# Altium project USB_Wireless_Module.PrjPcb
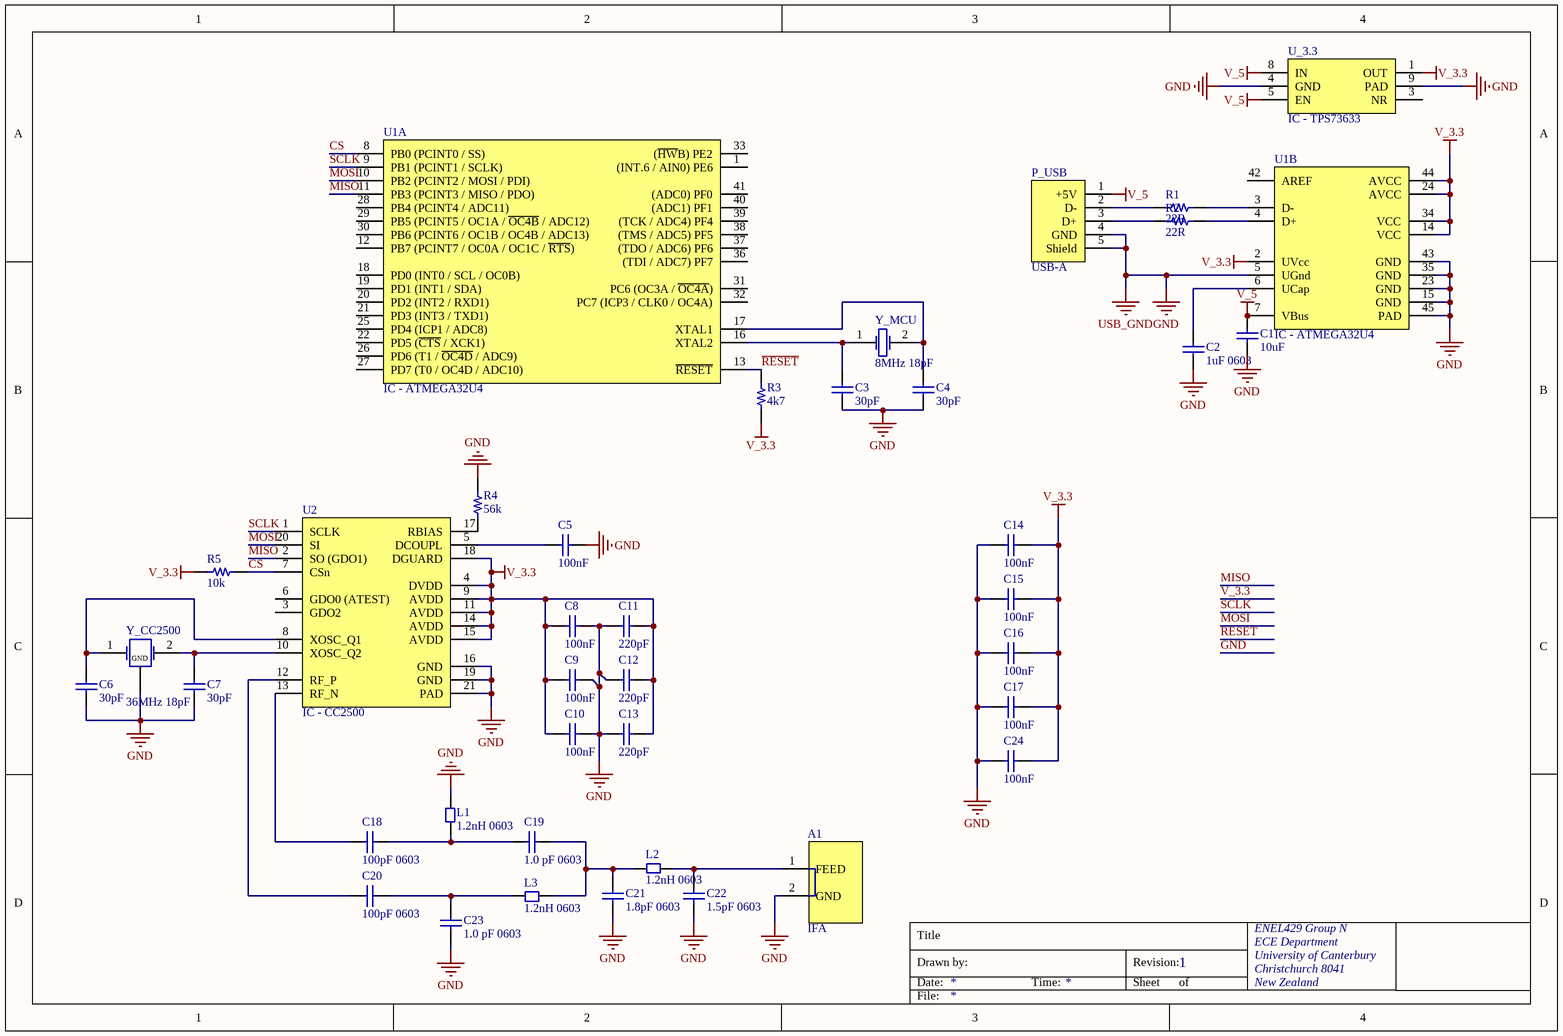
[diagram p0: USB_Wireless_Module.SchDoc]
1 sheet, 39 parts. Net scope: global (net labels, ports and power ports of the same name join across sheets).
Board file: USB_Wireless_Module.PcbDoc

## Sheet USB_Wireless_Module.SchDoc
size A4; Organization: ENEL429 Group N; Address1: ECE Department; Address2: University of Canterbury; Address3: Christchurch 8041; Address4: New Zealand; Revision: 1

### Parts
A1  IFA  [Meandered_Inverted_F_Antenna]
C1  10uF  [0603]
C2  1uF 0603  [0603]
C3  30pF  [0603]
C4  30pF  [0603]
C5  100nF  [0603]
C6  30pF  [0603]
C7  30pF  [0603]
C8  100nF  [0603]
C9  100nF  [0603]
C10  100nF  [0603]
C11  220pF  [0603]
C12  220pF  [0603]
C13  220pF  [0603]
C14  100nF  [0603]
C15  100nF  [0603]
C16  100nF  [0603]
C17  100nF  [0603]
C18  100pF 0603  [0603]
C19  1.0 pF 0603  [0603]
C20  100pF 0603  [0603]
C21  1.8pF 0603  [0603]
C22  1.5pF 0603  [0603]
C23  1.0 pF 0603  [0603]
C24  100nF  [0603]
L1  1.2nH 0603  [0603]
L2  1.2nH 0603  [0603]
L3  1.2nH 0603  [0603]
P_USB  USB-A  [480372200]
R1  22R  [0603]
R2  22R  [0603]
R3  4k7  [0603]
R4  56k  [0603]
R5  10k  [0603]
U1  IC - ATMEGA32U4  [QFN50P700X700X90-44N]  (parts A,B of 2)
U2  IC - CC2500  [TI - RTK / QFN50P400X400X90-20N]
U_3.3  IC - TPS73633  [TI - DRB / QFN65P300X300X100-8L]
Y_CC2500  36MHz 18pF  [7M-36.000MAAJ-T]
Y_MCU  8MHz 18pF  [ABM7-8.000MHZ-D-2-Y-T]

### Nets
GND: A1.2(GND) C1.1 C2.1 C3.1 C4.1 C5.2 C6.1 C7.1 C8.1 C9.1 C10.1 C11.1 C12.1 C13.1 C14.2 C15.2 C16.2 C17.2 C21.1 C22.1 C23.1 C24.2 L1.2 P_USB.4(GND) P_USB.5(Shield) R4.2 U1.5(UGnd) U1.15(GND) U1.23(GND) U1.35(GND) U1.43(GND) U1.45(PAD) U2.16(GND) U2.19(GND) U2.21(PAD) U_3.3.4(GND) U_3.3.9(PAD) Y_CC2500.3(GND)  [also labelled USB_GND]
V_3.3: C8.2 C9.2 C10.2 C11.2 C12.2 C13.2 C14.1 C15.1 C16.1 C17.1 C24.1 R3.1 R5.2 U1.2(UVcc) U1.14(VCC) U1.24(AVCC) U1.34(VCC) U1.44(AVCC) U2.4(DVDD) U2.9(AVDD) U2.11(AVDD) U2.14(AVDD) U2.15(AVDD) U2.18(DGUARD) U_3.3.1(OUT)
V_5: C1.2 P_USB.1(+5V) U1.7(VBus) U_3.3.5(EN) U_3.3.8(IN)
CS: R5.1 U1.8(PB0_(PCINT0_/_SS)) U2.7(CSn)
MISO: U1.11(PB3_(PCINT3_/_MISO_/_PDO)) U2.2(SO_(GDO1))
MOSI: U1.10(PB2_(PCINT2_/_MOSI_/_PDI)) U2.20(SI)
~{RESET}: R3.2 U1.13(~{RESET})
SCLK: U1.9(PB1_(PCINT1_/_SCLK)) U2.1(SCLK)
NetA1_1: A1.1(FEED) C22.2 L2.2
NetC2_2: C2.2 U1.6(UCap)
NetC3_2: C3.2 U1.16(XTAL2) Y_MCU.1
NetC4_2: C4.2 U1.17(XTAL1) Y_MCU.2
NetC5_1: C5.1 U2.5(DCOUPL)
NetC6_2: C6.2 U2.8(XOSC_Q1) Y_CC2500.1
NetC7_2: C7.2 U2.10(XOSC_Q2) Y_CC2500.2
NetC18_1: C18.1 U2.13(RF_N)
NetC18_2: C18.2 C19.1 L1.1
NetC19_2: C19.2 C21.2 L2.1 L3.1
NetC20_1: C20.1 U2.12(RF_P)
NetC20_2: C20.2 C23.2 L3.2
NetP_USB_2: P_USB.2(D-) R1.1
NetP_USB_3: P_USB.3(D+) R2.1
NetR1_2: R1.2 U1.3(D-)
NetR2_2: R2.2 U1.4(D+)
NetR4_1: R4.1 U2.17(RBIAS)

Not connected (* = marked no-connect by the designer): U1 1((INT.6_/_AIN0)_PE6) 12(PB7_(PCINT7_/_OC0A_/_OC1C_/_~{RTS})) 18(PD0_(INT0_/_SCL_/_OC0B)) 19(PD1_(INT1_/_SDA)) 20(PD2_(INT2_/_RXD1)) 21(PD3_(INT3_/_TXD1)) 22(PD5_(~{CTS}_/_XCK1)) 25(PD4_(ICP1_/_ADC8)) 26(PD6_(T1_/_~{OC4D}_/_ADC9)) 27(PD7_(T0_/_OC4D_/_ADC10)) 28(PB4_(PCINT4_/_ADC11)) 29(PB5_(PCINT5_/_OC1A_/_~{OC4B}_/_ADC12)) 30(PB6_(PCINT6_/_OC1B_/_OC4B_/_ADC13)) 31(PC6_(OC3A_/_~{OC4A})) 32(PC7_(ICP3_/_CLK0_/_OC4A)) 33((~{HW}B)_PE2) 36((TDI_/_ADC7)_PF7) 37((TDO_/_ADC6)_PF6) 38((TMS_/_ADC5)_PF5) 39((TCK_/_ADC4)_PF4) 40((ADC1)_PF1) 41((ADC0)_PF0) 42(AREF); U2 3(GDO2) 6(GDO0_(ATEST)); U_3.3 3(NR)

### Notes on the sheet
- Title
- Drawn by:
- Date:
- Time:
- Revision:
- Sheet
- of
- File:

### Library data of the parts
A1 = Meandered_Inverted_F_Antenna
C1 = CP - 10uF 0603: CAP CER 10000PF 50V X7R 0603; Manufacturer: TDK Corporation; Manufacturer Part Number: C1608X7R1H103M; Tolerance: ±20%; Supplier 1: Digi-Key; Supplier Part Number 1: 445-5090-1-ND; RoHS: RoHS Compliant; Category: Capacitors; Stock 1: 7957; Pricing 1: 1=0.08, 10=0.05, 100=0.018, 250=0.013, 500=0.0096, 1000=0.0065 (USD); Capacitance: 10000pF; Voltage - Rated: 50V; Temperature Coefficient: X7R; Mounting Type: Surface Mount, MLCC; Operating Temperature: -55°C ~ 125°C; Applications: General Purpose; Ratings: -; Package / Case: 0603 (1608 Metric); Size / Dimension: 0.063" L x 0.031" W (1.60mm x 0.80mm); Height: -; Thickness: 0.037" (0.95mm); Lead Spacing: -; Features: -; Packaging: Cut Tape (CT); Lead Style: -; ComponentLink1URL: http://www.tdk.com/pdf/general_B11.pdf; ComponentLink1Description: http://www.tdk.com/pdf/general_B11.pdf
C2 = CP - 1uF 0603: CAP CER 1.0UF 50V X5S 0603; Manufacturer: Taiyo Yuden; Manufacturer Part Number: UMK107C5105KA-T; Capacitance: 1.0µF; Tolerance: ±10%; Supplier Part Number 1: 587-1257-1-ND; Supplier 1: Digi-Key; RoHS: RoHS Compliant; Category: Capacitors; Stock 1: 0; Voltage - Rated: 50V; Temperature Coefficient: X5S; Mounting Type: Surface Mount, MLCC; Operating Temperature: -55°C ~ 85°C; Applications: General Purpose; Ratings: -; Package / Case: 0603 (1608 Metric); Size / Dimension: 0.063" L x 0.031" W (1.60mm x 0.80mm); Height: -; Thickness: 0.035" (0.90mm); Lead Spacing: -; Features: -; Packaging: Cut Tape (CT); Lead Style: -; ComponentLink1URL: http://media.digikey.com/pdf/Data%20Sheets/Taiyo%20Yuden%20PDFs%20URL%20links/High%20Value%20Multilayer%20Ceramic%20Caps.pdf; ComponentLink1Description: http://media.digikey.com/pdf/Data%20Sheets/Taiyo%20Yuden%20PDFs%20URL%20links/High%20Value%20Multilayer%20Ceramic%20Caps.pdf
C3 C4 C6 C7 = CP - 30pF 0603: CAP CER 30PF 50V C0G 0603; Manufacturer: TDK Corporation; Manufacturer Part Number: C1608C0G1H300J; Tolerance: ±5%; Temperature Coefficient: C0G, NP0; Supplier 1: Digi-Key; RoHS: RoHS Compliant; Category: Capacitors; Stock 1: 25238; Pricing 1: 1=0.13, 10=0.083, 100=0.0297, 250=0.02144, 500=0.01584, 1000=0.01073 (USD); Capacitance: 30pF; Voltage - Rated: 50V; Mounting Type: Surface Mount, MLCC; Operating Temperature: -55°C ~ 125°C; Applications: General Purpose; Ratings: -; Package / Case: 0603 (1608 Metric); Size / Dimension: 0.063" L x 0.031" W (1.60mm x 0.80mm); Height: -; Thickness: 0.037" (0.95mm); Lead Spacing: -; Features: -; Packaging: Cut Tape (CT); Lead Style: -; ComponentLink1URL: http://www.tdk.com/pdf/general_B11.pdf; ComponentLink1Description: http://www.tdk.com/pdf/general_B11.pdf; Supplier Part Number 1: 445-5054-1-ND
C5 C8-C10 C14-C17 C24 = CP - 100nF 0603: CAP CER .10UF 50V X5R 0603; Manufacturer: AVX Corporation; Manufacturer Part Number: 06035D104KAT2A; Capacitance: 0.1µF; Tolerance: ±10%; Supplier 1: Digi-Key; Supplier Part Number 1: 478-6206-1-ND; RoHS: RoHS Compliant; Category: Capacitors; Stock 1: 0; Pricing 1: 10=0.33, 100=0.195, 500=0.1125, 1000=0.078 (USD); Voltage - Rated: 50V; Temperature Coefficient: X5R; Mounting Type: Surface Mount, MLCC; Operating Temperature: -55°C ~ 85°C; Applications: General Purpose; Ratings: -; Package / Case: 0603 (1608 Metric); Size / Dimension: 0.063" L x 0.032" W (1.60mm x 0.81mm); Height: -; Thickness: 0.035" (0.90mm); Lead Spacing: -; Features: -; Packaging: Cut Tape (CT); Lead Style: -; ComponentLink1URL: http://www.avx.com/docs/Catalogs/cx5r.pdf; ComponentLink1Description: http://www.avx.com/docs/Catalogs/cx5r.pdf
C11-C13 = CP - 220pF 0603: CAP CER 220PF 50V NP0 0603; Manufacturer: Johanson Dielectrics Inc; Manufacturer Part Number: 500R14N221JV4T; Tolerance: ±5%; Temperature Coefficient: C0G, NP0; Supplier 1: Digi-Key; RoHS: RoHS Compliant; Category: Capacitors; Stock 1: 21369; Pricing 1: 10=0.047, 100=0.028, 500=0.01612, 1000=0.01118 (USD); Capacitance: 220pF; Voltage - Rated: 50V; Mounting Type: Surface Mount, MLCC; Operating Temperature: -55°C ~ 125°C; Applications: General Purpose; Ratings: -; Package / Case: 0603 (1608 Metric); Size / Dimension: 0.063" L x 0.032" W (1.60mm x 0.81mm); Height: -; Thickness: 0.035" (0.89mm); Lead Spacing: -; Features: -; Packaging: Cut Tape (CT); Lead Style: -; ComponentLink1URL: http://www.johansondielectrics.com/images/stories/surface-mount/smt-mlc/JDI_Surface-Mount_2008-11.pdf; ComponentLink1Description: http://www.johansondielectrics.com/images/stories/surface-mount/smt-mlc/JDI_Surface-Mount_2008-11.pdf; Supplier Part Number 1: 709-1148-1-ND
C18 C20 = CP - 100pF 0603: CAP CERM 100PF 5% 50V NP0 0603; Manufacturer: AVX Corporation; Manufacturer Part Number: 06035A101JAT2A; Temperature Coefficient: C0G, NP0; Supplier 1: Digi-Key; RoHS: RoHS Compliant; Category: Capacitors; Stock 1: 1724543; Pricing 1: 10=0.028, 100=0.0163, 500=0.00938, 1000=0.0065 (USD); Capacitance: 100pF; Voltage - Rated: 50V; Tolerance: ±5%; Mounting Type: Surface Mount, MLCC; Operating Temperature: -55°C ~ 125°C; Applications: General Purpose; Ratings: -; Package / Case: 0603 (1608 Metric); Size / Dimension: 0.063" L x 0.032" W (1.60mm x 0.81mm); Height: -; Thickness: 0.035" (0.90mm); Lead Spacing: -; Features: -; Packaging: Cut Tape (CT); Lead Style: -; ComponentLink1URL: http://www.avx.com/docs/Catalogs/ccog.pdf; ComponentLink1Description: http://www.avx.com/docs/Catalogs/ccog.pdf; Supplier Part Number 1: 478-1175-1-ND
C19 C23 = CP - 1.0pF 0603: CAP CER 1.0PF 50V C0G 0603; Manufacturer: TDK Corporation; Manufacturer Part Number: C1608C0G1H010C; Tolerance: ±0.25pF; Temperature Coefficient: C0G, NP0; Supplier 1: Digi-Key; RoHS: RoHS Compliant; Category: Capacitors; Stock 1: 89185; Pricing 1: 1=0.09, 10=0.058, 100=0.0207, 250=0.01496, 500=0.01104, 1000=0.00748 (USD); Capacitance: 1.0pF; Voltage - Rated: 50V; Mounting Type: Surface Mount, MLCC; Operating Temperature: -55°C ~ 125°C; Applications: General Purpose; Ratings: -; Package / Case: 0603 (1608 Metric); Size / Dimension: 0.063" L x 0.031" W (1.60mm x 0.80mm); Height: -; Thickness: 0.037" (0.95mm); Lead Spacing: -; Features: -; Packaging: Cut Tape (CT); Lead Style: -; ComponentLink1URL: http://www.tdk.com/pdf/general_B11.pdf; ComponentLink1Description: http://www.tdk.com/pdf/general_B11.pdf; Supplier Part Number 1: 445-5009-1-ND
C21 = CP - 1.8pF 0603: CAP CER 1.8PF 50V C0G 0603; Manufacturer: TDK Corporation; Manufacturer Part Number: C1608C0G1H1R8C; Tolerance: ±0.25pF; Temperature Coefficient: C0G, NP0; Supplier 1: Digi-Key; RoHS: RoHS Compliant; Category: Capacitors; Stock 1: 2092; Pricing 1: 1=0.12, 10=0.075, 100=0.027, 250=0.01952, 500=0.0144, 1000=0.00975 (USD); Capacitance: 1.8pF; Voltage - Rated: 50V; Mounting Type: Surface Mount, MLCC; Operating Temperature: -55°C ~ 125°C; Applications: General Purpose; Ratings: -; Package / Case: 0603 (1608 Metric); Size / Dimension: 0.063" L x 0.031" W (1.60mm x 0.80mm); Height: -; Thickness: 0.037" (0.95mm); Lead Spacing: -; Features: -; Packaging: Cut Tape (CT); Lead Style: -; ComponentLink1URL: http://www.tdk.com/pdf/general_B11.pdf; ComponentLink1Description: http://www.tdk.com/pdf/general_B11.pdf; Supplier Part Number 1: 445-5015-1-ND
C22 = CP - 1.5pF 0603: CAP CER 1.5PF 50V C0G 0603; Manufacturer: TDK Corporation; Manufacturer Part Number: C1608C0G1H1R5C; Tolerance: ±0.25pF; Temperature Coefficient: C0G, NP0; Supplier 1: Digi-Key; RoHS: RoHS Compliant; Category: Capacitors; Stock 1: 31690; Pricing 1: 1=0.09, 10=0.058, 100=0.0207, 250=0.01496, 500=0.01104, 1000=0.00748 (USD); Capacitance: 1.5pF; Voltage - Rated: 50V; Mounting Type: Surface Mount, MLCC; Operating Temperature: -55°C ~ 125°C; Applications: General Purpose; Ratings: -; Package / Case: 0603 (1608 Metric); Size / Dimension: 0.063" L x 0.031" W (1.60mm x 0.80mm); Height: -; Thickness: 0.037" (0.95mm); Lead Spacing: -; Features: -; Packaging: Cut Tape (CT); Lead Style: -; ComponentLink1URL: http://www.tdk.com/pdf/general_B11.pdf; ComponentLink1Description: http://www.tdk.com/pdf/general_B11.pdf; Supplier Part Number 1: 445-5013-1-ND
L1-L3 = L - 1.2nH 0603: INDUCTOR HI FREQ 1.2+/-0.3NH; Manufacturer: Taiyo Yuden; Manufacturer Part Number: HK16081N2S-T; Current: 300mA; Type: Ceramic; Tolerance: ±0.3nH; DC Resistance (DCR): 50 mOhm Max; Q @ Freq: 8 @ 100MHz; Self Resonant Freq: 10GHz; Frequency - Test: 100MHz; Supplier 1: Digi-Key; RoHS: RoHS Compliant; Category: Inductors, Coils, Chokes; Stock 1: 35758; Pricing 1: 1=0.07, 10=0.064, 50=0.06, 100=0.056, 500=0.044, 1000=0.036 (USD); Inductance: 1.2nH; Current - Saturation: -; Current - Temperature Rise: -; Shielding: -; Package / Case: 0603 (1608 Metric); Mounting Type: Surface Mount; Packaging: Cut Tape (CT); Operating Temperature: -40°C ~ 85°C; Material - Core: -; Applications: General Purpose; ComponentLink1URL: http://www.yuden.co.jp/ut/product/pdf/mlci04_e.pdf; ComponentLink1Description: http://www.yuden.co.jp/ut/product/pdf/mlci04_e.pdf; Supplier Part Number 1: 587-1534-1-ND
P_USB = H - USB A Plug SMD: CONN PLUG USB A 4POS SMD R/A; Manufacturer: Molex Inc; Manufacturer Part Number: 0480372200; Number of Contacts: 4; Specifications: USB 2.0; Supplier 1: Digi-Key; RoHS: RoHS Compliant; Category: Connectors, Interconnects; Stock 1: 5447; Pricing 1: 1=1.62, 10=1.263, 50=1.0684, 100=0.9635 (USD); Connector Type: USB - A; Gender: Plug; Mounting Type: Surface Mount, Right Angle, Horizontal; Features: Shielded; Packaging: Cut Tape (CT); Ingress Protection: -; ComponentLink1URL: http://www.molex.com/elqNow/elqRedir.htm?ref=http://www.molex.com/pdm_docs/sd/480372200_sd.pdf; ComponentLink1Description: http://www.molex.com/elqNow/elqRedir.htm?ref=http://www.molex.com/pdm_docs/sd/480372200_sd.pdf; Supplier Part Number 1: WM3983CT-ND
R1 R2 = RS - 22R 0603: RES 22 OHM 1/10W 5% 0603 SMD; Manufacturer: Yageo; Manufacturer Part Number: RC0603JR-0722RL; Resistance (Ohms): 22; Power (Watts): 0.1W, 1/10W; Temperature Coefficient: ±100ppm/°C; Supplier 1: Digi-Key; Supplier Part Number 1: 311-22GRCT-ND; RoHS: RoHS Compliant; Category: Resistors; Stock 1: 124; Pricing 1: 10=0.01, 50=0.008, 100=0.006, 250=0.00448, 500=0.00332, 1000=0.00221 (USD); Composition: Thick Film; Features: -; Tolerance: ±5%; Size / Dimension: 0.063" L x 0.031" W (1.60mm x 0.80mm); Height: 0.022" (0.55mm); Number of Terminations: 2; Packaging: Cut Tape (CT); Package / Case: 0603 (1608 Metric); ComponentLink1URL: http://www.yageo.com/documents/recent/PYu-RC0603_51_RoHS_L_4.pdf; ComponentLink1Description: http://www.yageo.com/documents/recent/PYu-RC0603_51_RoHS_L_4.pdf
R3 = RS - 4k7 0603: RES 4.70K OHM 1/10W 1% 0603 SMD; Manufacturer: Rohm Semiconductor; Manufacturer Part Number: MCR03EZPFX4701; Resistance (Ohms): 4.7K; Power (Watts): 0.1W, 1/10W; Temperature Coefficient: ±100ppm/°C; Supplier 1: Digi-Key; Supplier Part Number 1: RHM4.70KHCT-ND; RoHS: RoHS Compliant; Category: Resistors; Stock 1: 384429; Pricing 1: 10=0.023, 50=0.0172, 100=0.0131, 250=0.00976, 500=0.0072, 1000=0.0048 (USD); Composition: Thick Film; Features: -; Tolerance: ±1%; Size / Dimension: 0.063" L x 0.031" W (1.60mm x 0.80mm); Height: 0.022" (0.55mm); Number of Terminations: 2; Packaging: Cut Tape (CT); Package / Case: 0603 (1608 Metric); ComponentLink1URL: http://www.rohm.com/products/databook/r/pdf/mcr03.pdf; ComponentLink1Description: http://www.rohm.com/products/databook/r/pdf/mcr03.pdf
R4 = RS - 56k 0603: RES 56K OHM 1/10W 5% 0603 SMD; Manufacturer: Yageo; Manufacturer Part Number: RC0603JR-0756KL; Power (Watts): 0.1W, 1/10W; Temperature Coefficient: ±100ppm/°C; Supplier 1: Digi-Key; Supplier Part Number 1: 311-56KGRCT-ND; RoHS: RoHS Compliant; Category: Resistors; Stock 1: 236462; Pricing 1: 10=0.01, 50=0.008, 100=0.006, 250=0.00448, 500=0.00332, 1000=0.00221 (USD); Resistance (Ohms): 56K; Composition: Thick Film; Features: -; Tolerance: ±5%; Size / Dimension: 0.063" L x 0.031" W (1.60mm x 0.80mm); Height: 0.022" (0.55mm); Number of Terminations: 2; Packaging: Cut Tape (CT); Package / Case: 0603 (1608 Metric); ComponentLink1URL: http://www.yageo.com/documents/recent/PYu-RC0603_51_RoHS_L_4.pdf; ComponentLink1Description: http://www.yageo.com/documents/recent/PYu-RC0603_51_RoHS_L_4.pdf
R5 = RS - 10k 0603: RES 10.0K OHM 1/10W 1% 0603 SMD; Manufacturer: Yageo; Manufacturer Part Number: RC0603FR-0710KL; Power (Watts): 0.1W, 1/10W; Temperature Coefficient: ±100ppm/°C; Supplier 1: Digi-Key; Supplier Part Number 1: 311-10.0KHRCT-ND; RoHS: RoHS Compliant; Category: Resistors; Stock 1: 9813840; Pricing 1: 10=0.014, 50=0.0104, 100=0.0079, 250=0.00584, 500=0.00432, 1000=0.00288 (USD); Resistance (Ohms): 10K; Composition: Thick Film; Features: -; Tolerance: ±1%; Size / Dimension: 0.063" L x 0.031" W (1.60mm x 0.80mm); Height: 0.022" (0.55mm); Number of Terminations: 2; Packaging: Cut Tape (CT); Package / Case: 0603 (1608 Metric); ComponentLink1URL: http://www.yageo.com/documents/recent/PYu-RC0603_51_RoHS_L_4.pdf; ComponentLink1Description: http://www.yageo.com/documents/recent/PYu-RC0603_51_RoHS_L_4.pdf
U1 = IC - ATMEGA32U4: MCU AVR 32K FLASH 16MHZ 44-QFN; Manufacturer: Atmel; Manufacturer Part Number: ATMEGA32U4-MU; Core Size: 8-Bit; Connectivity: I²C, SPI, UART/USART, USB; Peripherals: Brown-out Detect/Reset, POR, PWM, WDT; Number of I /O: 26; Program Memory Size: 32KB (16K x 16); EEPROM Size: 1K x 8; RAM Size: 2.5K x 8; Voltage - Supply (Vcc/Vdd): 2.7 V ~ 5.5 V; Data Converters: A/D 12x10b; Oscillator Type: External; Supplier 1: Digi-Key; RoHS: RoHS Compliant; Category: Integrated Circuits (ICs); Stock 1: 6137; Pricing 1: 1=6.04, 25=3.7896, 100=3.3684 (USD); Core Processor: AVR; Speed: 16MHz; Program Memory Type: FLASH; Operating Temperature: -40°C ~ 85°C; Package / Case: 44-VQFN; Packaging: Tray; ComponentLink1URL: http://www.atmel.com/dyn/resources/prod_documents/doc7766.pdf; ComponentLink1Description: http://www.atmel.com/dyn/resources/prod_documents/doc7766.pdf; Supplier Part Number 1: ATMEGA32U4-MU-ND
U2 = IC - CC2500: IC RF TXRX SNGL-CHIP LP 20-QFN; Manufacturer: Texas Instruments; Manufacturer Part Number: CC2500RTKR; Frequency: 2.4GHz; Data Rate - Maximum: 500kBaud; Modulation or Protocol: 2-FSK, ASK, GFSK, MSK, OOK; Power - Output: -30dBm ~ 10dBm; Sensitivity: -104dBm; Voltage - Supply: 1.8 V ~ 3.6 V; Current - Receiving: 17mA; Current - Transmitting: 21.5mA @ 1 dBm; Data Interface: PCB, Surface Mount; Supplier 1: Digi-Key; RoHS: RoHS Compliant; Category: RF/IF and RFID; Stock 1: 20005; Pricing 1: 1=4.2, 25=3.43, 100=3.08, 250=2.8, 500=2.45, 1000=2.1 (USD); Applications: ISM, SRD; Memory Size: -; Antenna Connector: PCB, Surface Mount; Operating Temperature: -40°C ~ 85°C; Package / Case: 20-VQFN Exposed Pad, 20-HVQFN, 20-SQFN, 20-DHVQFN; Packaging: Cut Tape (CT); ComponentLink1URL: http://focus.ti.com/lit/ds/symlink/cc2500.pdf; ComponentLink1Description: http://focus.ti.com/lit/ds/symlink/cc2500.pdf; Supplier Part Number 1: 296-19586-1-ND
U_3.3 = IC - TPS73633: IC LDO REG 400MA NO CAP 8-SON; Manufacturer: Texas Instruments; Manufacturer Part Number: TPS73633DRBR; Regulator Topology: Positive Fixed; Voltage - Output: 3.3V; Voltage - Input: Up to 5.5V; Voltage - Dropout (Typical): 0.075V @ 400mA; Number of Regulators: 1; Current - Output: 400mA (Max); Supplier 1: Digi-Key; RoHS: RoHS Compliant; Category: Integrated Circuits (ICs); Stock 1: 6005; Pricing 1: 1=3.15, 25=2.43, 100=2.205, 250=1.98, 500=1.71, 1000=1.44 (USD); Current - Limit (Min): 400mA; Operating Temperature: -40°C ~ 125°C; Mounting Type: Surface Mount; Package / Case: 8-VDFN Exposed Pad; Supplier Device Package: 8-SON Exposed Pad (3x3); Packaging: Cut Tape (CT); ComponentLink1URL: http://focus.ti.com/lit/ds/symlink/tps73601.pdf; ComponentLink1Description: http://focus.ti.com/lit/ds/symlink/tps73601.pdf; Supplier Part Number 1: 296-17884-1-ND
Y_CC2500 = X - 36MHz 18pF: CRYSTAL 36.000 MHZ 18PF SMD; Manufacturer: TXC CORPORATION; Frequency Stability: ±30ppm; Operating Mode: Fundamental; Supplier 1: Digi-Key; Manufacturer Part Number: 7M-36.000MAAJ-T; RoHS: RoHS Compliant; Category: Crystals and Oscillators; Stock 1: 5817; Pricing 1: 1=1.31, 10=1.138, 50=0.9976, 100=0.7875, 500=0.665, 1000=0.525 (USD); Type: MHz Crystal; Frequency: 36MHz; Frequency Tolerance: ±30ppm; Load Capacitance: 18pF; Operating Temperature: -20°C ~ 70°C; Mounting Type: Surface Mount; Package / Case: 4-SMD, No Lead (DFN, LCC); Size / Dimension: 0.126" L x 0.098" W (3.20mm x 2.50mm); Height: 0.031" (0.80mm); Packaging: Cut Tape (CT); ComponentLink1URL: http://www.txccrystal.com/images/pdf/7m.pdf; ComponentLink1Description: http://www.txccrystal.com/images/pdf/7m.pdf; Supplier Part Number 1: 887-1137-1-ND
Y_MCU = X - 8MHz 18pF: CRYSTAL 8.0000 MHZ 18PF SMD; Manufacturer: Abracon Corporation; Frequency Stability: ±30ppm; Frequency Tolerance: ±20ppm; Operating Mode: Fundamental; Supplier 1: Digi-Key; Manufacturer Part Number: ABM7-8.000MHZ-D-2-Y-T; RoHS: RoHS Compliant; Category: Crystals and Oscillators; Stock 1: 25365; Pricing 1: 1=1.31, 10=1.138, 50=0.9976, 100=0.7875, 500=0.665 (USD); Type: MHz Crystal; Frequency: 8MHz; Load Capacitance: 18pF; Operating Temperature: -40°C ~ 85°C; Mounting Type: Surface Mount; Package / Case: 2-SMD; Size / Dimension: 0.236" L x 0.138" W (6.00mm x 3.50mm); Height: 0.055" (1.40mm); Packaging: Cut Tape (CT); ComponentLink1URL: http://www.abracon.com/Resonators/abm7.pdf; ComponentLink1Description: http://www.abracon.com/Resonators/abm7.pdf; Supplier Part Number 1: 535-9831-1-ND